# Altium schematic sheet VUE_PIC32_v1_0_PowerOut.SchDoc: [VUE32 - (Up to) 10A switched output]
size A4; Engineer: JFDuval; Revision: 1.0
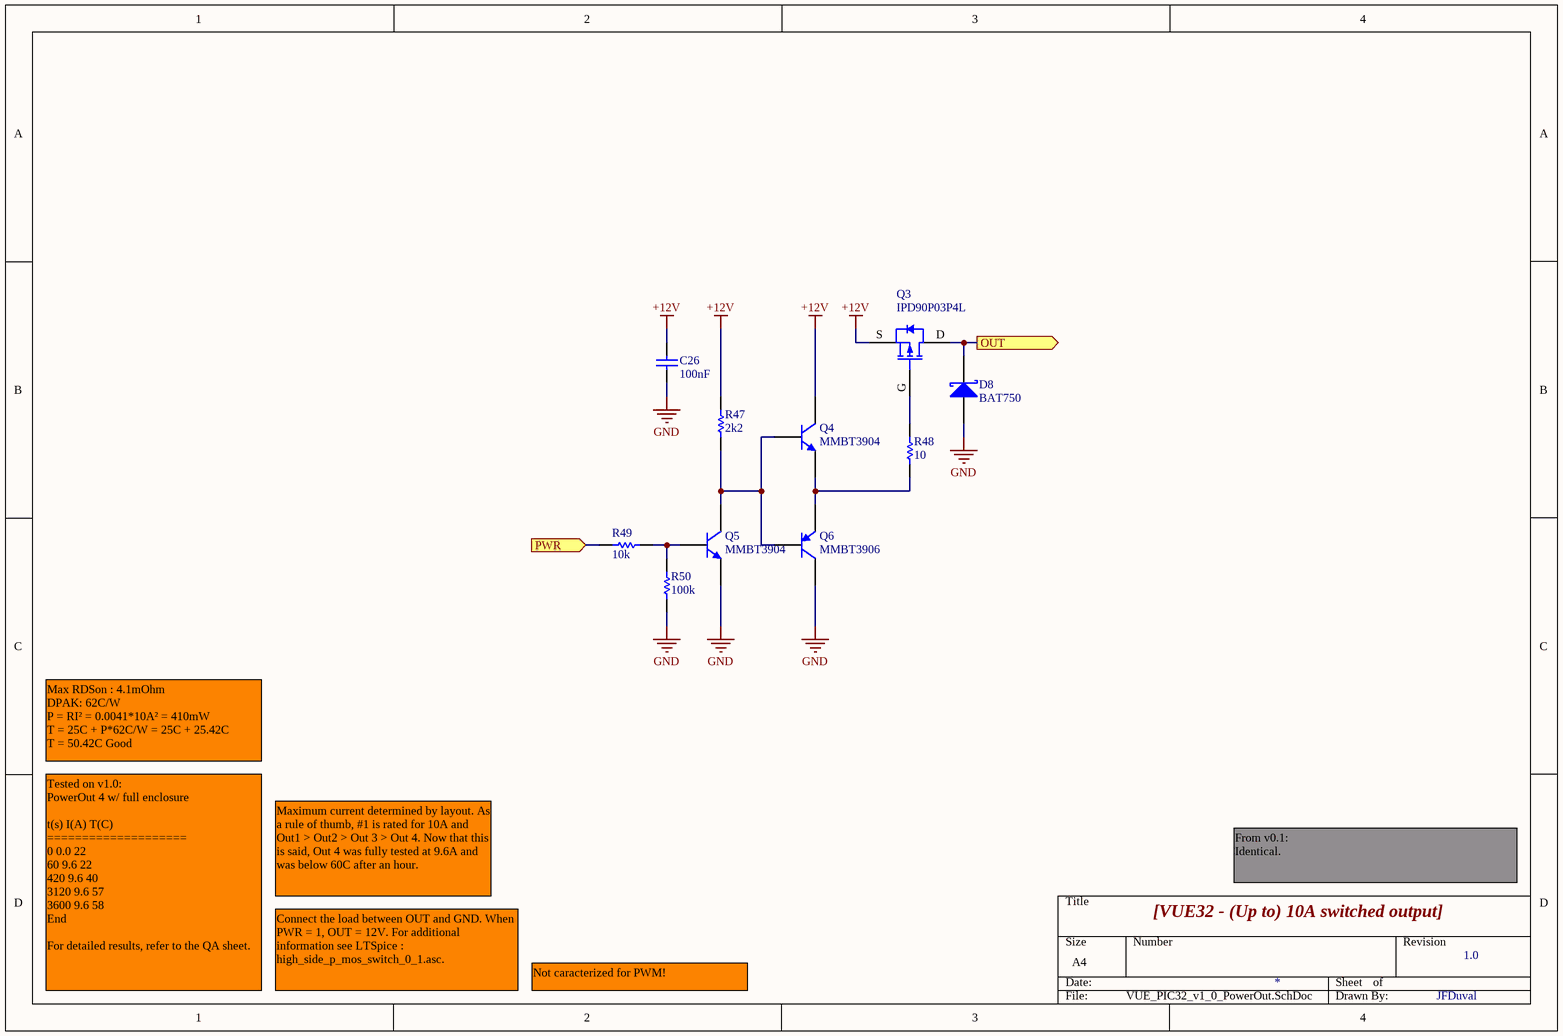
[diagram p0: VUE_PIC32_v1_0_PowerOut.SchDoc]

## Parts
C26  100nF  [0402C]
D8  BAT750  [SOT23-3]
Q3  IPD90P03P4L  [TO-252_DPAK]
Q4  MMBT3904  [SC-75/SOT-416]
Q5  MMBT3904  [SC-75/SOT-416]
Q6  MMBT3906  [SC-75/SOT-416]
R47  2k2  [0402]
R48  10  [0402]
R49  10k  [0402]
R50  100k  [0402]

## Ports
OUT (out), PWR (in)

## Nets
+12V: C26.2 Q3.S Q4.3(C) R47.2
GND: C26.1 D8.1(A) Q5.2(E) Q6.3(C) R50.1
OUT: D8.3(K) Q3.D ; port OUT
PWR: R49.1 ; port PWR
NetQ3_G: Q3.G R48.2
NetQ4_1: Q4.1(B) Q5.3(C) Q6.1(B) R47.1
NetQ4_2: Q4.2(E) Q6.2(E) R48.1
NetQ5_1: Q5.1(B) R49.2 R50.2

## Notes on the sheet
- Max RDSon : 4.1mOhm
  DPAK: 62C/W
  P = RI² = 0.0041*10A² = 410mW
  T = 25C + P*62C/W = 25C + 25.42C
  T = 50.42C Good
- Maximum current determined by layout. As a rule of thumb, #1 is rated for 10A and Out1 > Out2 > Out 3 > Out 4. Now that this is said, Out 4 was fully tested at 9.6A and was below 60C after an hour.
- From v0.1:
  Identical.
- Tested on v1.0:
  PowerOut 4 w/ full enclosure
  t(s)	I(A)	T(C)
  ====================
  0	0.0	22
  60	9.6	22
  420	9.6	40
  3120	9.6	57
  3600	9.6	58
  End
  For detailed results, refer to the QA sheet.
- Connect the load between OUT and GND. When PWR = 1, OUT = 12V. For additional information see LTSpice :
  high_side_p_mos_switch_0_1.asc.
- Not caracterized for PWM!

## Library data of the parts
C26 = CAP_TDK_C_0402_100nF_25V: CAP CER 0.1UF 25V Y5V 0402; MfgPartNumber: C1005Y5V1E104Z; Mfg: TDK; Value: 100nF; Digikey: 445-3445-1-ND
D8 = DIODE_DIODESINC_BAT750_SCHOTTKY_SOT23_40V_750MA: DIODE SCHOTTKY 40V 750MA SOT23-3; MfgPartNumber: BAT750TA; Mfg: Diodes/Zetex; Digikey: BAT750CT-ND; Value: BAT750
Q3 = MOSFET_INFINEON_P_CH_IOD90P03P4L_30V_DPAK: MOSFET P-CH 30V 90A TO252-3; MfgPartNumber: IPD90P03P4L-04; Mfg: Infineon Technologies; Digikey: IPD90P03P4L-04INCT-ND; Value: IPD90P03P4L
Q4 Q5 = BJT_ONSEMI_NPN_MMBT3904_40V_200MA_SC75: TRANS GP SS NPN 40V SOT416; MfgPartNumber: MMBT3904TT1G; Mfg: ON Semiconductor; Digikey: MMBT3904TT1GOSCT-ND; Value: MMBT3904
Q6 = BJT_ONSEMI_PNP_MMBT3906_40V_200MA_SC75: TRANS PNP GP 40V 200MA SC75-3; MfgPartNumber: MMBT3906TT1G; Mfg: ON Semiconductor; Digikey: MMBT3906TT1GOSCT-ND; Value: MMBT3906
R47 = RES_YAGEO_0402_2K2_1PCT: RES 2.20K OHM 1/16W 1% 0402 SMD; MfgPartNumber: RC0402FR-072K2L; Mfg: Yageo; Digikey: 311-2.20KLRCT-ND; Value: 2k2
R48 = RES_YAGEO_0402_10_1PCT: RES 10.0 OHM 1/16W 1% 0402 SMD; MfgPartNumber: RC0402FR-0710RL; Mfg: Yageo; Digikey: 311-10.0LRCT-ND; Value: 10
R49 = RES_YAGEO_0402_10K_1PCT: RES 10.0K OHM 1/16W 1% 0402 SMD; MfgPartNumber: RC0402FR-0710KL; Mfg: Yageo; Digikey: 311-10.0KLRCT-ND; Value: 10k
R50 = RES_YAGEO_0402_100K_1PCT: RES 100K OHM 1/16W 1% 0402 SMD; MfgPartNumber: RC0402FR-07100KL; Mfg: Yageo; Digikey: 311-100KLRCT-ND; Value: 100k